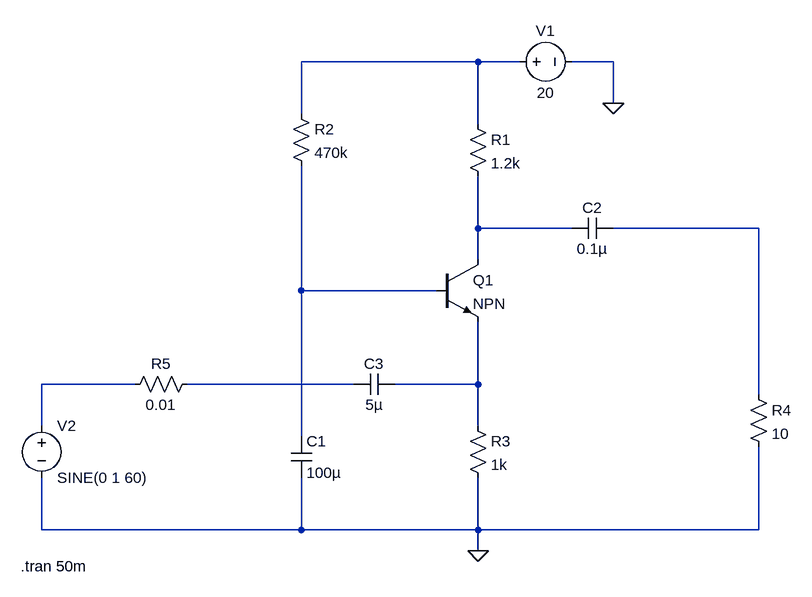
[diagram p0: schematic BJTTransistorAsSwitch.asc]
BJTTransistorAsSwitch.asc, the LTspice schematic file:
Version 4.1
SHEET 1 880 680
WIRE 304 -128 32 -128
WIRE 368 -128 304 -128
WIRE 512 -128 448 -128
WIRE 512 -64 512 -128
WIRE 32 -48 32 -128
WIRE 304 -32 304 -128
WIRE 304 128 304 48
WIRE 448 128 304 128
WIRE 736 128 512 128
WIRE 304 176 304 128
WIRE 32 224 32 32
WIRE 240 224 32 224
WIRE -224 368 -368 368
WIRE 112 368 -144 368
WIRE 304 368 304 272
WIRE 304 368 176 368
WIRE 736 384 736 128
WIRE -368 432 -368 368
WIRE 304 432 304 368
WIRE 32 448 32 224
WIRE -368 592 -368 512
WIRE 32 592 32 512
WIRE 32 592 -368 592
WIRE 304 592 304 512
WIRE 304 592 32 592
WIRE 736 592 736 464
WIRE 736 592 304 592
WIRE 304 624 304 592
FLAG 512 -64 0
FLAG 304 624 0
SYMBOL voltage 352 -128 R270
WINDOW 0 32 56 VTop 2
WINDOW 3 -32 56 VBottom 2
WINDOW 123 0 0 Left 0
WINDOW 39 0 0 Left 0
SYMATTR InstName V1
SYMATTR Value 20
SYMBOL res 288 -48 R0
SYMATTR InstName R1
SYMATTR Value 1.2k
SYMBOL res 16 -64 R0
SYMATTR InstName R2
SYMATTR Value 470k
SYMBOL res 288 416 R0
SYMATTR InstName R3
SYMATTR Value 1k
SYMBOL npn 240 176 R0
SYMATTR InstName Q1
SYMBOL cap 16 448 R0
SYMATTR InstName C1
SYMATTR Value 100µ
SYMBOL res 720 368 R0
SYMATTR InstName R4
SYMATTR Value 10
SYMBOL cap 512 112 R90
WINDOW 0 0 32 VBottom 2
WINDOW 3 32 32 VTop 2
SYMATTR InstName C2
SYMATTR Value 0.1µ
SYMBOL res -128 352 R90
WINDOW 0 0 56 VBottom 2
WINDOW 3 32 56 VTop 2
SYMATTR InstName R5
SYMATTR Value 0.01
SYMBOL cap 176 352 R90
WINDOW 0 0 32 VBottom 2
WINDOW 3 32 32 VTop 2
SYMATTR InstName C3
SYMATTR Value 5µ
SYMBOL voltage -368 416 R0
WINDOW 123 0 0 Left 0
WINDOW 39 0 0 Left 0
SYMATTR InstName V2
SYMATTR Value SINE(0 1 60)
TEXT -400 648 Left 2 !.tran 50m

The netlist it stands for:
* BJTTransistorAsSwitch.asc
V1 N001 0 20
R1 N001 N002 1.2k
R2 N001 N004 470k
R3 N007 0 1k
Q1 N002 N004 N007 0 NPN
C1 N004 0 100µ
R4 N003 0 10
C2 N003 N002 0.1µ
R5 N006 N005 0.01
C3 N007 N006 5µ
V2 N005 0 SINE(0 1 60)
.model NPN NPN
.model PNP PNP
.lib standard.bjt
.tran 50m
.backanno
.end